# Altium project PAACUE_V2.PrjPcb
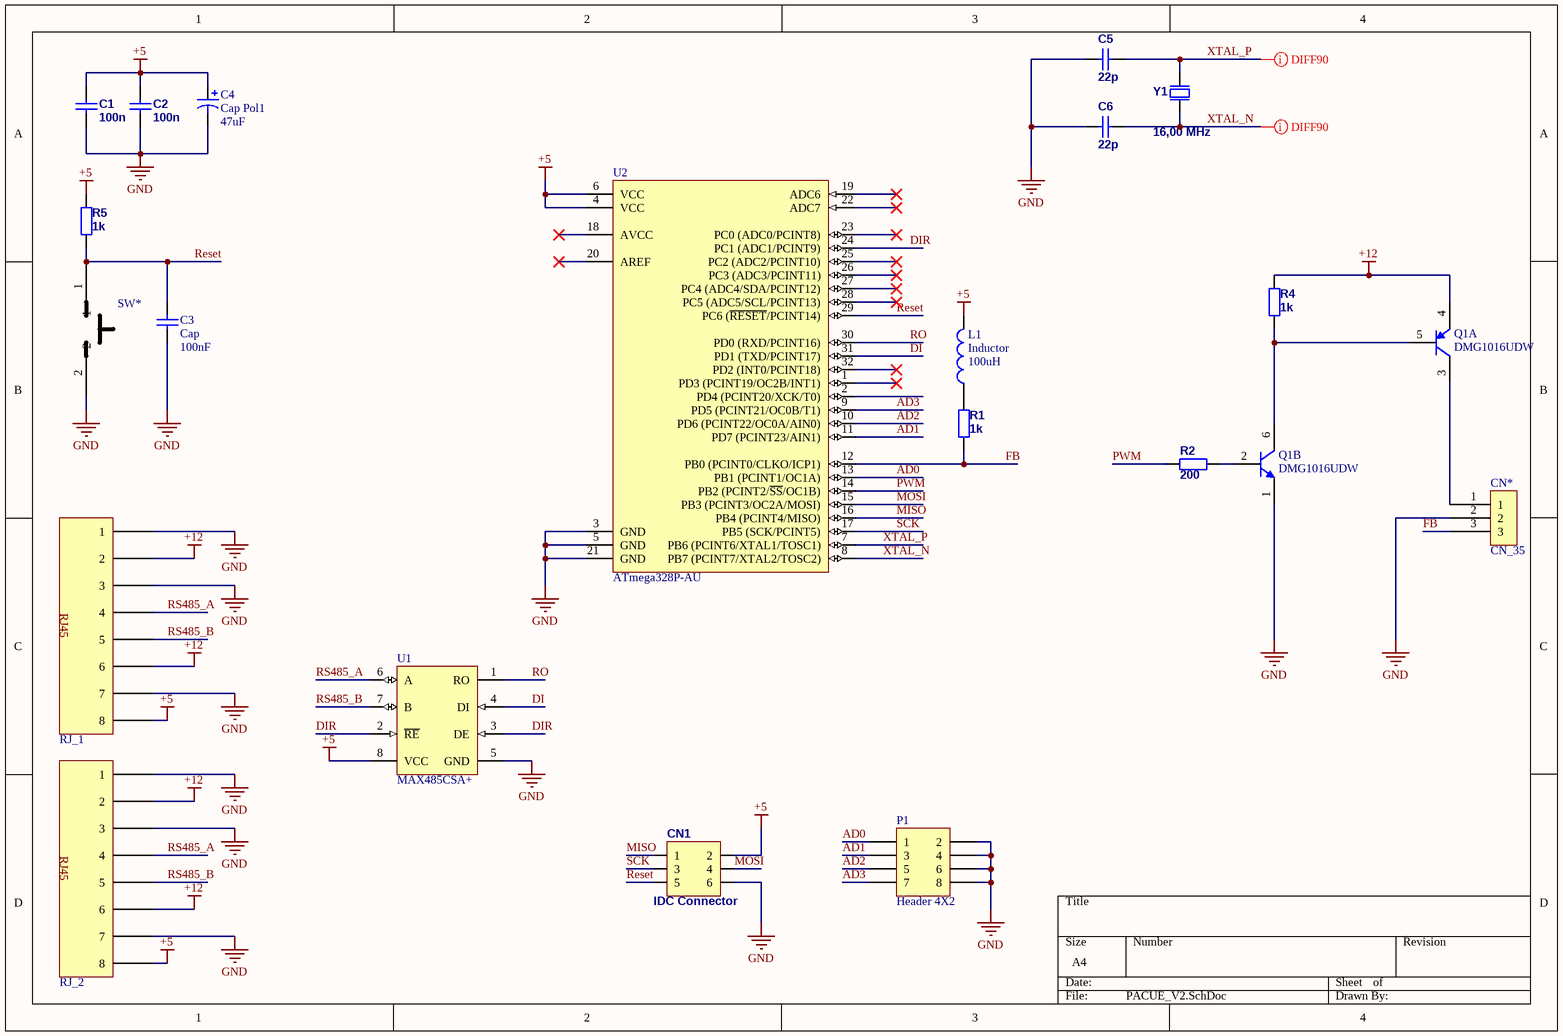
[diagram p0: PACUE_V2.SchDoc]
1 sheet, 21 parts. Net scope: global (net labels, ports and power ports of the same name join across sheets).
Board file: PACUE_V2.PcbDoc

## Sheet PACUE_V2.SchDoc
size A4

### Parts
C1  100n  [C0603]
C2  100n  [C0603]
C3  Cap  value 100nF  [C0805]
C4  Cap Pol1  value 47uF  [CES_A_3.3x3.3_5.4]
C5  22p  [C0603]
C6  22p  [C0603]
CN1  IDC Connector  [IDC6]
CN*  CN_35  [PCBComponent_1]
L1  Inductor  value 100uH  [L1210]
P1  Header 4X2  [HDR2X4]
Q1  DMG1016UDW  [ONSC-SOT-363-6-419B-02_V]  (parts A,B of 2)
R1  1k  [R0603]
R2  200  [R0603]
R4  1k  [R0603]
R5  1k  [R0805]
RJ_1  RJ_45SE  [RJ_45SE]  (value not drawn)
RJ_2  RJ_45SE  [RJ_45SE]  (value not drawn)
SW*  DTS32_switch  [DTS32]  (value not drawn)
U1  MAX485CSA+  [MAXM-MAX485CSA+-8_M]
U2  ATmega328P-AU  [32A_M]
Y1  16,00 MHz  [5,0x3,2x0,9mm]

### Nets
+5: C1.1 C2.1 C4.1 CN1.2 L1.2 R5.2 RJ_1.8 RJ_2.8 U1.8(VCC) U2.4(VCC) U2.6(VCC)
+12: Q1.4(E) R4.2 RJ_1.2 RJ_1.6 RJ_2.2 RJ_2.6
GND: C1.2 C2.2 C3.1 C4.2 C5.1 C6.1 CN1.6 CN*.2 P1.2 P1.4 P1.6 P1.8 Q1.1(E) RJ_1.1 RJ_1.3 RJ_1.7 RJ_2.1 RJ_2.3 RJ_2.7 SW*.2 U1.5(GND) U2.3(GND) U2.5(GND) U2.21(GND) Y1.2(GND) Y1.4(GND)
AD0: P1.1 U2.13(PB1_(PCINT1/OC1A))
AD1: P1.3 U2.11(PD7_(PCINT23/AIN1))
AD2: P1.5 U2.10(PD6_(PCINT22/OC0A/AIN0))
AD3: P1.7 U2.9(PD5_(PCINT21/OC0B/T1))
DI: U1.4(DI) U2.31(PD1_(TXD/PCINT17))
DIR: U1.2(~{RE}) U1.3(DE) U2.24(PC1_(ADC1/PCINT9))
FB: CN*.3 R1.1 U2.12(PB0_(PCINT0/CLKO/ICP1))
MISO: CN1.1 U2.16(PB4_(PCINT4/MISO))
MOSI: CN1.4 U2.15(PB3_(PCINT3/OC2A/MOSI))
PWM: R2.1 U2.14(PB2_(PCINT2/~{SS}/OC1B))
Reset: C3.2 CN1.5 R5.1 SW*.1 U2.29(PC6_(~{RESET}/PCINT14))
RO: U1.1(RO) U2.30(PD0_(RXD/PCINT16))
RS485_A: RJ_1.4 RJ_2.4 U1.6(A)
RS485_B: RJ_1.5 RJ_2.5 U1.7(B)
SCK: CN1.3 U2.17(PB5_(SCK/PCINT5))
XTAL_N: C6.2 U2.8(PB7_(PCINT7/XTAL2/TOSC2)) Y1.1(OSC1)
XTAL_P: C5.2 U2.7(PB6_(PCINT6/XTAL1/TOSC1)) Y1.3(OSC2)
NetCN*_1: CN*.1 Q1.3(C)
NetL1_1: L1.1 R1.2
NetQ1_2: Q1.2(B) R2.2
NetQ1_5: Q1.5(B) Q1.6(C) R4.1

Not connected (* = marked no-connect by the designer): U2 1(PD3_(PCINT19/OC2B/INT1))* 2(PD4_(PCINT20/XCK/T0)) 18(AVCC)* 19(ADC6)* 20(AREF)* 22(ADC7)* 23(PC0_(ADC0/PCINT8))* 25(PC2_(ADC2/PCINT10))* 26(PC3_(ADC3/PCINT11))* 27(PC4_(ADC4/SDA/PCINT12))* 28(PC5_(ADC5/SCL/PCINT13))* 32(PD2_(INT0/PCINT18))*

### Layout directives
differential pair: XTAL_N, XTAL_P

### Notes on the sheet
- (in symbol RJ_45SE) RJ45

### Library data of the parts
C1-C3 C5 C6 = Cap: Capacitor
  C1 C2: ComponentLink1Description: datasheet; ComponentLink2Description: supplier; Value: 100n
  C3: Published: 8-Jun-2000; LatestRevisionDate: 17-Jul-2002; LatestRevisionNote: Re-released for DXP Platform.; PackageReference: RAD-0.3; Publisher: Altium Limited; PackageDescription: Radial Cap, Thru-Hole; 2 Leads; 0.3 in Pin Spacing
  C5 C6: ComponentLink1Description: datasheet; ComponentLink2Description: supplier; Value: 22p
C4 = Cap Pol1: Polarized Capacitor (Radial); Published: 8-Jun-2000; LatestRevisionDate: 17-Jul-2002; LatestRevisionNote: Re-released for DXP Platform.; PackageReference: RB7.6-15; Publisher: Altium Limited; PackageDescription: Polarized Capacitor (Radial); 2 Leads
CN1 = CN_3x2
L1 = Inductor: Code_IEC: 1005; Published: 8-Jun-2000; LatestRevisionDate: 29-May-2009; LatestRevisionNote: IPC-7351 Footprint Added.; PackageReference: 0402-A; Publisher: Altium Limited; PackageDescription: Chip Inductor; Code_JEITA: 0402
P1 = Header 4X2: Header, 4-Pin, Dual row; LatestRevisionDate: 17-Jul-2002; LatestRevisionNote: Re-released for DXP Platform.; Publisher: Altium Limited
Q1 = CMP-1048-00846-1: Dual General Purpose Transistors, NPN / PNP (Complementary), 6-Pin SOT-363, Pb-Free, Tape and Reel; PartNumber: BC847BPDW1T1G; Manufacturer: On Semiconductor; fT Min (MHz): 100; IC Continuous (A): 0.1; PackageDescription: 6-Pin Small Outline Transistor, Body 2 x 1.25 mm, Pitch 0.65 mm; PackageReference: SOT-363-6-419B-02; PackageVersion: Rev. Y, 12/2012; RoHS: TRUE; Packing: Tape and Reel; ComponentLink3Description: Package Specification; Polarity: Complementary; Mounting Technology: Surface Mount; ComponentLink2Description: Datasheet; ComponentLink1Description: Manufacturer URL; ComponentLink1URL: http://www.onsemi.com/; DatasheetVersion: Rev. 9; ComponentLink2URL: http://www.onsemi.cn/pub_link/Collateral/BC846BPDW1T1-D.PDF; ComponentLink3URL: http://www.onsemi.cn/pub_link/Collateral/419B-02.PDF
R1 R2 R4 R5 = Res: Resistor; Published: 19-Feb-2006; ComponentLink1Description: datasheet; ComponentLink2Description: supplier
  R1 R4 R5: Value: 1k
  R2: Value: 200
U1 = CMP-2000-05211-1: Low-Power, Slew-Rate-Limited RS-485/RS-422 Transceiver, 4.75 to 5.25 V, 0 to 70 degC, 8-Pin SOIC, RoHS, Tape and Reel; Manufacturer: Maxim; No. of Receivers: 1; Transceiver Type: Differential; Supply Voltage Min: 4.75V; IC Generic Number: 485; IC Temperature Range: Commercial; No. of Pins: 8; Supply Voltage Range: 4.75Vto5.25V; Interface: RS-422/RS-485; Supply Voltage Max: 5.25V; Data Rate: 2.5Mbps; Line / Bus Driver / Receiver / Transceiver Type: CMOSDifferential; Supply Current: 500µA; Interface Type: RS422,RS485; Device Type: Transceiver; Manufacturer URL: http://www.maximintegrated.com/; Operating Temperature Range: 0degCto+70degC; Package / Case: SOIC; Digital IC Case Style: SOIC; Operating Temperature Max: 70degC; Device Marking: MAX485CSA+; Driver Case Style: SOIC; Datasheet Version: Rev. 8, 10/2003; Operating Temperature Min: 0degC; Datasheet URL: https://datasheet.ciiva.com/29306/170071-da-01-en-ic-max485csa-so8-29306144.pdf; Base Number: 485; No. of Drivers: 1; Logic Function Number: 485
U2 = CMP-0095-00269-2: 8-bit AVR Microcontroller, 32KB Flash, 1KB EEPROM, 2KB SRAM, 32-pin TQFP, Industrial Grade (-40°C to 85°C); PackageDescription: 32-Lead, 7x7x1.0 mm Body, 0.8mm Lead Pitch, Thin Profile Plastic Quad Flat Package (TQFP); DatasheetVersion: revD, May-2011; RevisionNote: DatasheetVersion & PackageVersion updated. URLs added.; ComponentLink1URL: http://www.atmel.com/; ComponentLink2Description: ATmega48A/48PA/88A/88PA/168A/168PA/328/328P Datasheet; Code_JEDEC: MS-026-ABA; ComponentLink1Description: Manufacturer URL; PackageReference: 32A; ComponentLink3Description: ATmega48A/48PA/88A/88PA/168A/168PA/328/328P Summary; ComponentLink2URL: http://www.atmel.com/dyn/resources/prod_documents/doc8271.pdf; PackageVersion: revC, Oct-2010; ComponentLink3URL: http://www.atmel.com/dyn/resources/prod_documents/8271S.pdf
Y1 = CFPX180-16.0M: 16,000MHz (+/- 30ppm), 3.2 x 2.5mm SMD Crystal; Value: 16,00 MHz; Supplier 1: TME; Supplier Part Number 1: 16.00M-CFPX180